# Altium schematic sheet serial_1.SchDoc
size A
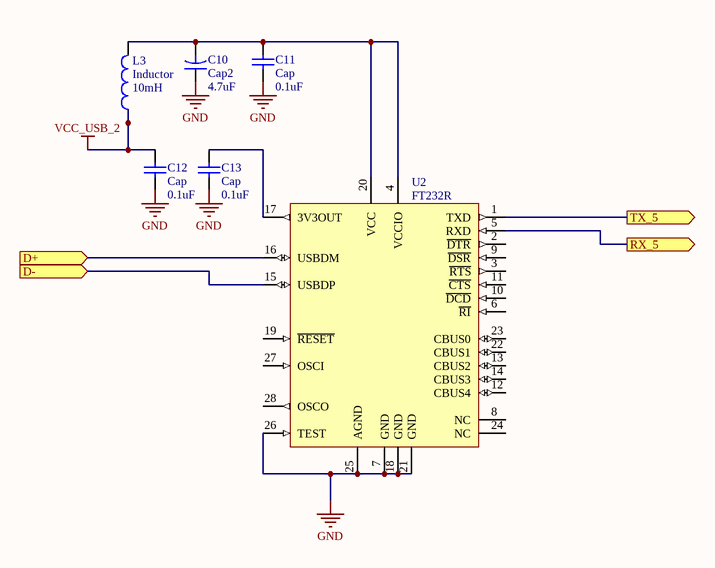
[diagram p0: serial_1.SchDoc]

## Parts
C10  Cap2  value 4.7uF  [CAPR5-4X5]
C11  Cap  value 0.1uF  [C0805]
C12  Cap  value 0.1uF  [C0805]
C13  Cap  value 0.1uF  [C0805]
L3  Inductor  value 10mH  [C0805]
U2  FT232R  [SSOP-28_N]

## Ports
D+ (in), D- (in), RX_5 (out), TX_5 (out)

## Nets
GND: C10.1 C11.1 C12.1 C13.1 U2.7(GND) U2.18(GND) U2.21(GND) U2.25(AGND) U2.26(TEST)
VCC_USB_2: C12.2 L3.1
D+: U2.16(USBDM) ; port D+
D-: U2.15(USBDP) ; port D-
RX_5: U2.5(RXD) ; port RX_5
TX_5: U2.1(TXD) ; port TX_5
NetC10_2: C10.2 C11.2 L3.2 U2.4(VCCIO) U2.20(VCC)
NetC13_2: C13.2 U2.17(3V3OUT)

Not connected (* = marked no-connect by the designer): U2 2(~{DTR}) 3(~{RTS}) 6(~{RI}) 8(NC) 9(~{DSR}) 10(~{DCD}) 11(~{CTS}) 12(CBUS4) 13(CBUS2) 14(CBUS3) 19(~{RESET}) 22(CBUS1) 23(CBUS0) 24(NC) 27(OSCI) 28(OSCO)

## Library data of the parts
C10 = Cap2: Capacitor; Published: 23-Sep-2002; PackageReference: CAPR5-4X5; Publisher: Altium Limited; PackageDescription: Capacitor; 2 Leads
C11-C13 = Cap: Capacitor; Published: 8-Jun-2000; LatestRevisionDate: 17-Jul-2002; LatestRevisionNote: Re-released for DXP Platform.; PackageReference: RAD-0.3; Publisher: Altium Limited; PackageDescription: Radial Cap, Thru-Hole; 2 Leads; 0.3 in Pin Spacing
L3 = Inductor: Code_IEC: 1005; Published: 8-Jun-2000; LatestRevisionDate: 29-May-2009; LatestRevisionNote: IPC-7351 Footprint Added.; PackageReference: 0402-A; Publisher: Altium Limited; PackageDescription: Chip Inductor; Code_JEITA: 0402
U2 = FT232RL-Tray: USB UART Asynchronous Serial Data Transfer Chip, SSOP-28, Tray; Published: 19-Aug-2010; DatasheetVersion: ver 2.07, Jul-2010; PackageVersion: 2010; PackageReference: SSOP-28; Publisher: Altium Limited; PackageDescription: 28-Pin Small Outline Package 0.65 mm Pitch; ComponentLink1Description: Manufacturer Link; ComponentLink1URL: http://www.ftdichip.com/Products/ICs/FT232R.htm; ComponentLink2Description: Datasheet; ComponentLink2URL: http://www.ftdichip.com/Support/Documents/DataSheets/ICs/DS_FT232R.pdf